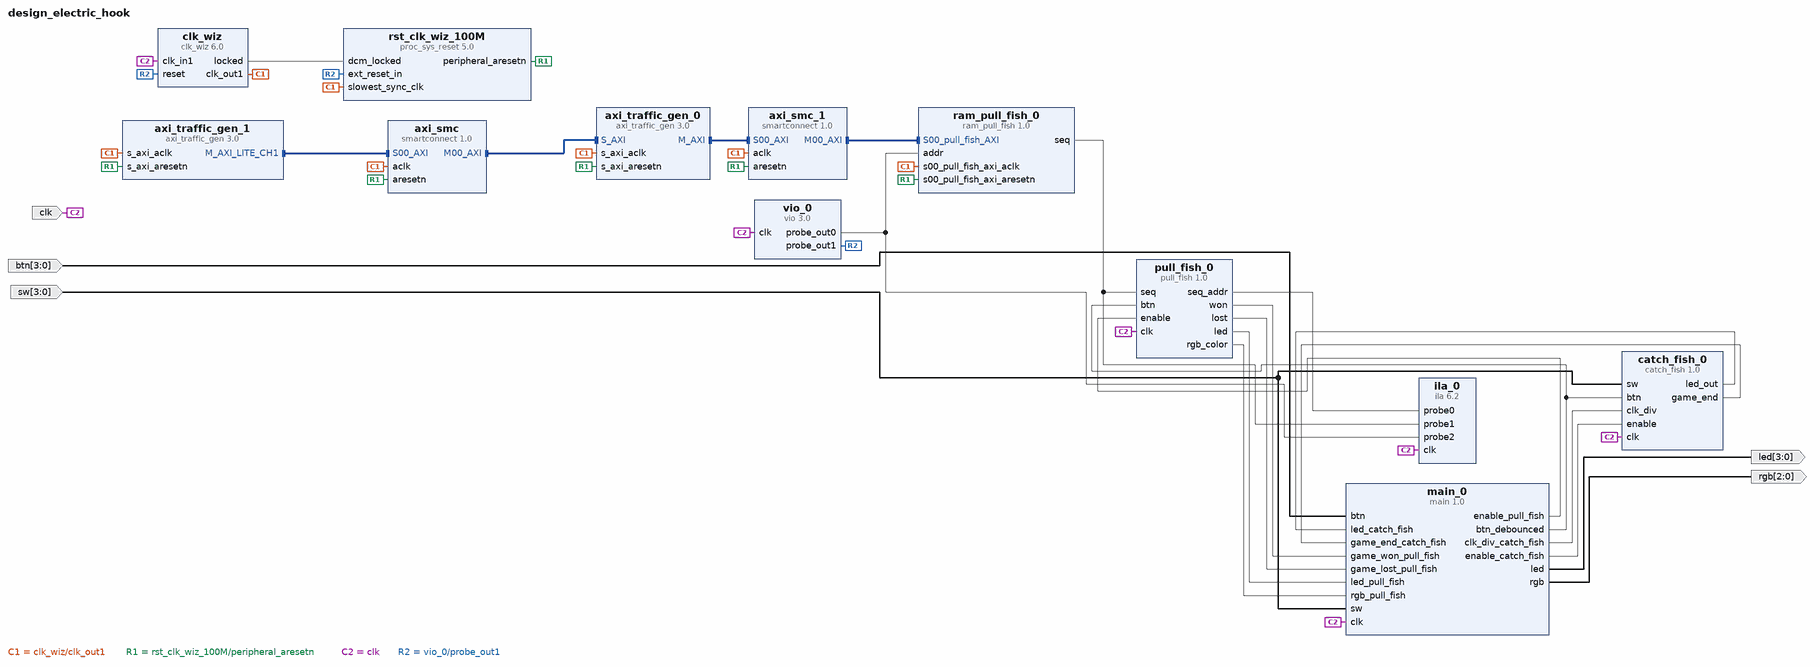
[diagram p0: block diagram of the top level]
# Vivado block design design_electric_hook, xc7z010clg400-1, Vivado 2020.1
create_bd_design design_electric_hook

create_bd_port -dir I -type clk clk
set_property -dict {CONFIG.FREQ_HZ 125000000} [get_bd_ports clk]
create_bd_port -dir I -from 3 -to 0 btn
create_bd_port -dir I -from 3 -to 0 sw
create_bd_port -dir O -from 3 -to 0 led
create_bd_port -dir O -from 2 -to 0 rgb

create_bd_cell -type ip -vlnv xilinx.com:ip:axi_traffic_gen:3.0 axi_traffic_gen_0
create_bd_cell -type ip -vlnv xilinx.com:ip:axi_traffic_gen:3.0 axi_traffic_gen_1
set_property -dict [list \
  CONFIG.C_ATG_MIF_DATA_DEPTH 32 \
  CONFIG.C_ATG_MODE AXI4-Lite \
  CONFIG.C_ATG_SYSINIT_MODES System_Test \
  CONFIG.C_ATG_SYSTEM_CMD_MAX_RETRY 2147483647 \
  CONFIG.C_ATG_SYSTEM_INIT_ADDR_MIF ../../../../../../../Ip_cores/coe_files_pull_fish/addr.coe \
  CONFIG.C_ATG_SYSTEM_INIT_CTRL_MIF ../../../../../../../Ip_cores/coe_files_pull_fish/ctrl.coe \
  CONFIG.C_ATG_SYSTEM_INIT_DATA_MIF ../../../../../../../Ip_cores/coe_files_pull_fish/data.coe \
  CONFIG.C_ATG_SYSTEM_INIT_MASK_MIF ../../../../../../../Ip_cores/coe_files_pull_fish/mask.coe \
] [get_bd_cells axi_traffic_gen_1]
create_bd_cell -type ip -vlnv xilinx.com:ip:smartconnect:1.0 axi_smc
set_property -dict {CONFIG.NUM_SI 1} [get_bd_cells axi_smc]
create_bd_cell -type ip -vlnv xilinx.com:ip:clk_wiz:6.0 clk_wiz
set_property -dict [list \
  CONFIG.CLKOUT1_JITTER 124.615 \
  CONFIG.CLKOUT1_REQUESTED_OUT_FREQ 100.000 \
  CONFIG.MMCM_CLKOUT0_DIVIDE_F 10.000 \
  CONFIG.USE_RESET true \
] [get_bd_cells clk_wiz]
create_bd_cell -type ip -vlnv xilinx.com:ip:proc_sys_reset:5.0 rst_clk_wiz_100M
create_bd_cell -type ip -vlnv xilinx.com:ip:smartconnect:1.0 axi_smc_1
set_property -dict {CONFIG.NUM_SI 1} [get_bd_cells axi_smc_1]
create_bd_cell -type ip -vlnv xilinx.com:user:catch_fish:1.0 catch_fish_0
create_bd_cell -type ip -vlnv xilinx.com:ip:ila:6.2 ila_0
set_property -dict [list \
  CONFIG.C_ENABLE_ILA_AXI_MON false \
  CONFIG.C_MONITOR_TYPE Native \
  CONFIG.C_NUM_OF_PROBES 3 \
  CONFIG.C_PROBE0_WIDTH 4 \
  CONFIG.C_PROBE1_WIDTH 16 \
  CONFIG.C_PROBE2_WIDTH 4 \
] [get_bd_cells ila_0]
create_bd_cell -type ip -vlnv xilinx.com:user:main:1.0 main_0
create_bd_cell -type ip -vlnv xilinx.com:user:pull_fish:1.0 pull_fish_0
create_bd_cell -type ip -vlnv xilinx.com:user:ram_pull_fish:1.0 ram_pull_fish_0
create_bd_cell -type ip -vlnv xilinx.com:ip:vio:3.0 vio_0
set_property -dict {CONFIG.C_NUM_PROBE_IN 0 CONFIG.C_NUM_PROBE_OUT 2 CONFIG.C_PROBE_OUT0_WIDTH 4} [get_bd_cells vio_0]

# ---- connections ----

connect_bd_intf_net [get_bd_intf_pins axi_traffic_gen_0/M_AXI] [get_bd_intf_pins axi_smc_1/S00_AXI]
connect_bd_intf_net [get_bd_intf_pins axi_smc/M00_AXI] [get_bd_intf_pins axi_traffic_gen_0/S_AXI]
connect_bd_intf_net [get_bd_intf_pins axi_smc_1/M00_AXI] [get_bd_intf_pins ram_pull_fish_0/S00_pull_fish_AXI]
connect_bd_intf_net [get_bd_intf_pins axi_traffic_gen_1/M_AXI_LITE_CH1] [get_bd_intf_pins axi_smc/S00_AXI]
connect_bd_net [get_bd_pins clk_wiz/clk_out1] \
  [get_bd_pins axi_traffic_gen_1/s_axi_aclk] [get_bd_pins axi_smc/aclk] [get_bd_pins rst_clk_wiz_100M/slowest_sync_clk] \
  [get_bd_pins axi_traffic_gen_0/s_axi_aclk] [get_bd_pins axi_smc_1/aclk] \
  [get_bd_pins ram_pull_fish_0/s00_pull_fish_axi_aclk]
connect_bd_net [get_bd_pins clk_wiz/locked] [get_bd_pins rst_clk_wiz_100M/dcm_locked]
connect_bd_net [get_bd_pins rst_clk_wiz_100M/peripheral_aresetn] \
  [get_bd_pins axi_traffic_gen_1/s_axi_aresetn] [get_bd_pins axi_traffic_gen_0/s_axi_aresetn] [get_bd_pins axi_smc/aresetn] \
  [get_bd_pins axi_smc_1/aresetn] [get_bd_pins ram_pull_fish_0/s00_pull_fish_axi_aresetn]
connect_bd_net -net clk_0_1 [get_bd_ports clk] \
  [get_bd_pins clk_wiz/clk_in1] [get_bd_pins catch_fish_0/clk] [get_bd_pins ila_0/clk] [get_bd_pins main_0/clk] \
  [get_bd_pins pull_fish_0/clk] [get_bd_pins vio_0/clk]
connect_bd_net -net btn_0_1 [get_bd_ports btn] [get_bd_pins main_0/btn]
connect_bd_net -net sw_0_1 [get_bd_ports sw] [get_bd_pins catch_fish_0/sw] [get_bd_pins main_0/sw]
connect_bd_net [get_bd_pins main_0/led] [get_bd_ports led]
connect_bd_net [get_bd_pins main_0/rgb] [get_bd_ports rgb]
connect_bd_net [get_bd_pins main_0/btn_debounced] [get_bd_pins catch_fish_0/btn] [get_bd_pins pull_fish_0/btn]
connect_bd_net [get_bd_pins main_0/clk_div_catch_fish] [get_bd_pins catch_fish_0/clk_div]
connect_bd_net [get_bd_pins main_0/enable_catch_fish] [get_bd_pins catch_fish_0/enable]
connect_bd_net [get_bd_pins catch_fish_0/led_out] [get_bd_pins main_0/led_catch_fish]
connect_bd_net [get_bd_pins catch_fish_0/game_end] [get_bd_pins main_0/game_end_catch_fish]
connect_bd_net [get_bd_pins pull_fish_0/won] [get_bd_pins main_0/game_won_pull_fish]
connect_bd_net [get_bd_pins pull_fish_0/lost] [get_bd_pins main_0/game_lost_pull_fish]
connect_bd_net [get_bd_pins main_0/enable_pull_fish] [get_bd_pins pull_fish_0/enable]
connect_bd_net [get_bd_pins pull_fish_0/led] [get_bd_pins main_0/led_pull_fish]
connect_bd_net [get_bd_pins pull_fish_0/rgb_color] [get_bd_pins main_0/rgb_pull_fish]
connect_bd_net [get_bd_pins vio_0/probe_out0] [get_bd_pins ram_pull_fish_0/addr] [get_bd_pins ila_0/probe2]
connect_bd_net [get_bd_pins pull_fish_0/seq_addr] [get_bd_pins ila_0/probe0]
connect_bd_net [get_bd_pins vio_0/probe_out1] [get_bd_pins clk_wiz/reset] [get_bd_pins rst_clk_wiz_100M/ext_reset_in]
connect_bd_net [get_bd_pins ram_pull_fish_0/seq] [get_bd_pins ila_0/probe1] [get_bd_pins pull_fish_0/seq]

# ---- address map ----
assign_bd_address -offset 0x76000000 -range 64K -target_address_space [get_bd_addr_spaces axi_traffic_gen_0/Data] [get_bd_addr_segs ram_pull_fish_0/S00_pull_fish_AXI/S00_pull_fish_AXI_mem]
assign_bd_address -offset 0x44A00000 -range 64K -target_address_space [get_bd_addr_spaces axi_traffic_gen_1/Reg1] [get_bd_addr_segs axi_traffic_gen_0/S_AXI/Reg0]

validate_bd_design
save_bd_design
